# Altium project OWLSAT Antenna PCB.PrjPcb
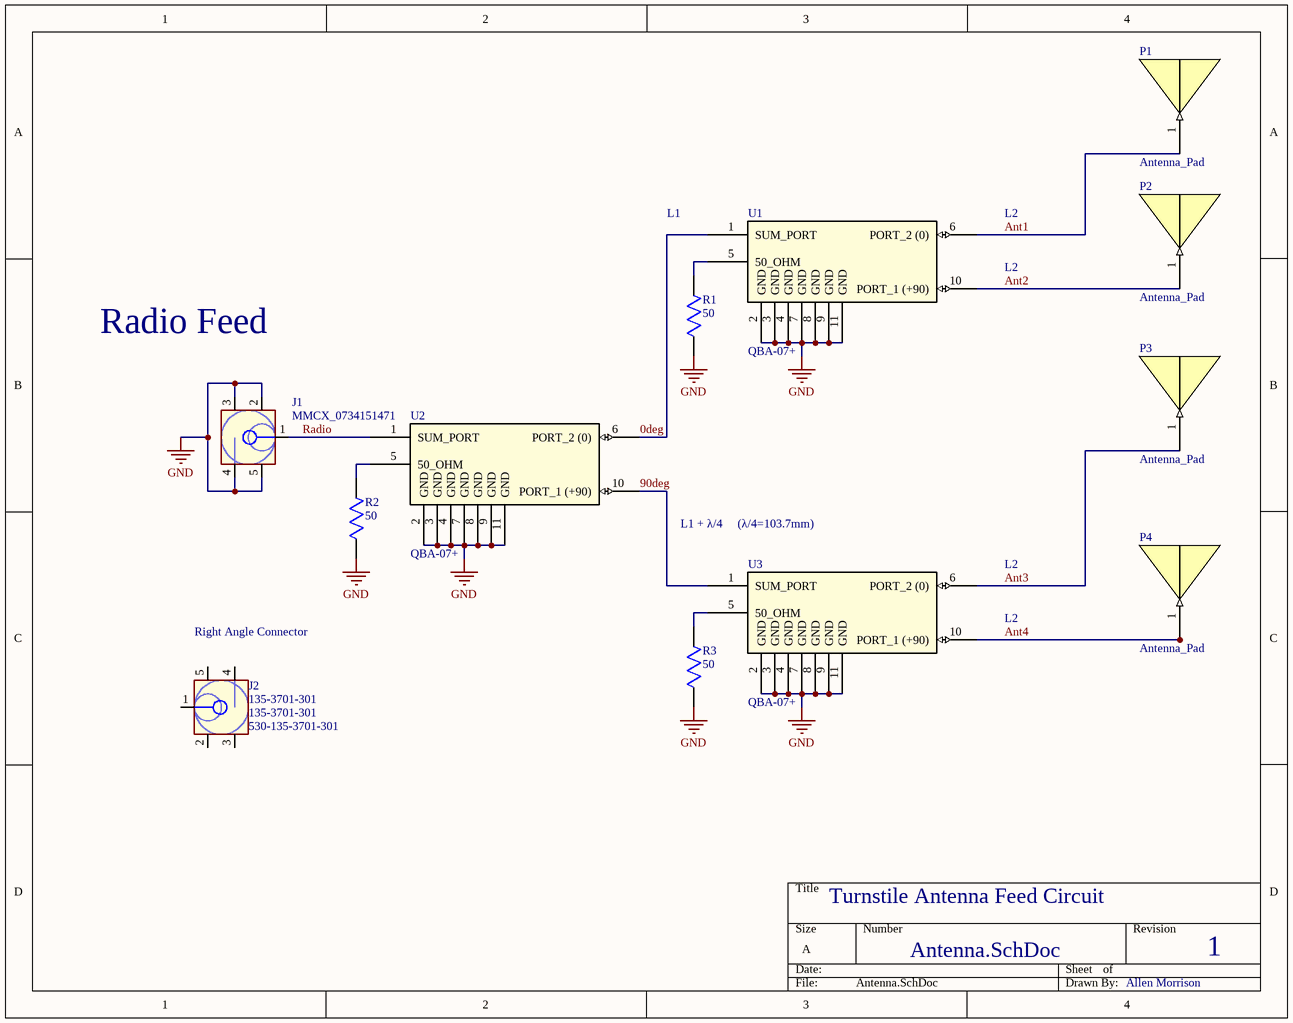
[diagram p0: Antenna.SchDoc]
1 sheet, 12 parts. Net scope: global (net labels, ports and power ports of the same name join across sheets).
Board file: Antenna.PcbDoc

## Sheet Antenna.SchDoc: Turnstile Antenna Feed Circuit
size A; DrawnBy: Allen Morrison; Revision: 1; SheetNumber: 1; SheetTotal: 1

### Parts
J1  MMCX_0734151471  [MMCX_0734151471]
J2  135-3701-301  Supplier Part Number 1: 530-135-3701-301  [MMCX_0734151471]  (mechanical)
P1  Antenna_Pad  [Antenna_Pad]  (no BOM)
P2  Antenna_Pad  [Antenna_Pad]  (no BOM)
P3  Antenna_Pad  [Antenna_Pad]  (no BOM)
P4  Antenna_Pad  [Antenna_Pad]  (no BOM)
R1  50  [R0402]
R2  50  [R0402]
R3  50  [R0402]
U1  QBA-07+  [SM1L_MNC]
U2  QBA-07+  [SM1L_MNC]
U3  QBA-07+  [SM1L_MNC]

### Nets
GND: J1.2 J1.3 J1.4 J1.5 R1.1 R2.1 R3.1 U1.2(GND) U1.3(GND) U1.4(GND) U1.7(GND) U1.8(GND) U1.9(GND) U1.11(GND) U2.2(GND) U2.3(GND) U2.4(GND) U2.7(GND) U2.8(GND) U2.9(GND) U2.11(GND) U3.2(GND) U3.3(GND) U3.4(GND) U3.7(GND) U3.8(GND) U3.9(GND) U3.11(GND)
0deg: U1.1(SUM_PORT) U2.6(PORT_2_(0))
90deg: U2.10(PORT_1_(+90)) U3.1(SUM_PORT)
Ant1: P1.1 U1.6(PORT_2_(0))
Ant2: P2.1 U1.10(PORT_1_(+90))
Ant3: P3.1 U3.6(PORT_2_(0))
Ant4: P4.1 U3.10(PORT_1_(+90))
Radio: J1.1 U2.1(SUM_PORT)
NetR1_2: R1.2 U1.5(50_OHM)
NetR2_2: R2.2 U2.5(50_OHM)
NetR3_2: R3.2 U3.5(50_OHM)

Not connected (* = marked no-connect by the designer): J2 1 2 3 4 5

### Notes on the sheet
- L1
- L2
- Radio Feed
- L1 + λ/4     (λ/4=103.7mm)
- (near J2) Right Angle Connector

### Library data of the parts
J1 = MMCX_Straight: Conn MMCX RCP 50Ohm Solder ST Thru-Hole Gold Bulk; Manufacturer Part Number: 73415-1471; ComponentLink1URL: https://datasheet.ciiva.com/7002/734151471-sd-7002529.pdf?src-supplier=Digi-Key; ComponentLink1Description: https://datasheet.ciiva.com/7002/734151471-sd-7002529.pdf?src-supplier=Digi-Key; Supplier 1: Avnet; Supplier Part Number 1: 0734151471
J2 = MMCX_Right: Supplier 1: Mouser; Manufacturer Part Number: 135-3701-301
R1-R3 = RES_50_0603_1.5W: 50 Ohm Space Resistor; Manufacturer Part Number: 311-430JRCT-ND; Manufacturer: Yageo; Manufacturer Part Number: RC0402JR-07430RL; Resistance: 430R; Tolerance: 5%; Temperature Coefficient: 100ppm/°C; Power Rating: 62.5mW; Voltage Rating: 50V; Max Power Dissipation: 63mW; RoHS: Yes; Category: Chip SMD Resistors; Stock 1: 521; Pricing 1: 1=0.10000, 10=0.01300, 100=0.00530, 1000=0.00236, 2500=0.00205, 5000=0.00169 (USD); Case/Package: 0402; Contact Plating: Tin,Matte; Case Code (Imperial): 0402; Case Code (Metric): 1005; Min Operating Temperature: -55°C; Max Operating Temperature: 155°C; Composition: Thick Film; Voltage Rating (DC): 50V; Packaging: Tape and Reel; Package Quantity: 1; Working Voltage: 50V; Termination: SMD/SMT; Number of Terminations: 2; Military Standard: Not; Features: Moisture Resistant; Length: 0.039inch; Height: 0.016inch; Width: 0.02inch; Depth: 0.5mm; Lead Free: Lead Free; ComponentLink1URL: https://datasheet.ciiva.com/2452/pyu-r-int-thick-7-2452725.pdf?src-supplier=Digi-Key; ComponentLink1Description: https://datasheet.ciiva.com/2452/pyu-r-int-thick-7-2452725.pdf?src-supplier=Digi-Key; ComponentLink2URL: https://datasheet.ciiva.com/16743/pyu-rc0402-51-rohs-l-6-r-16743893.pdf?src-supplier=Future+Electronics; ComponentLink2Description: https://datasheet.ciiva.com/16743/pyu-rc0402-51-rohs-l-6-r-16743893.pdf?src-supplier=Future+Electronics; ComponentLink3URL: https://datasheet.ciiva.com/16863/pyu-rc0402-51-rohs-l-6-16863285.pdf?src-supplier=Avnet+Europe; ComponentLink3Description: https://datasheet.ciiva.com/16863/pyu-rc0402-51-rohs-l-6-16863285.pdf?src-supplier=Avnet+Europe; ComponentLink4URL: https://datasheet.ciiva.com/2452/pyu-r-int-thick-7-2452726.pdf?src-supplier=Digi-Key; ComponentLink4Description: https://datasheet.ciiva.com/2452/pyu-r-int-thick-7-2452726.pdf?src-supplier=Digi-Key; ComponentLink5URL: https://datasheet.ciiva.com/2452/pyu-r-int-thick-7-2452727.pdf?src-supplier=Digi-Key; ComponentLink5Description: https://datasheet.ciiva.com/2452/pyu-r-int-thick-7-2452727.pdf?src-supplier=Digi-Key; ComponentLink6URL: https://datasheet.ciiva.com/28390/pyu-rc0402-51-rohs-l-6-28390744.pdf?src-supplier=Avnet+Europe; ComponentLink6Description: https://datasheet.ciiva.com/28390/pyu-rc0402-51-rohs-l-6-28390744.pdf?src-supplier=Avnet+Europe; Supplier 1: Digi-Key; Supplier Part Number 1: 541-2655-1-ND
U1-U3 = QBA-07+: No Description Available; Mfr_Name: Mini Circuits; Copyright: Copyright (C) 2022 Ultra Librarian. All rights reserved.; RefDes: RefDes; Type: DEV; Manufacturer Part Number: QBA-07+